# EAGLE design mains_top (EAGLE 8.6.0)
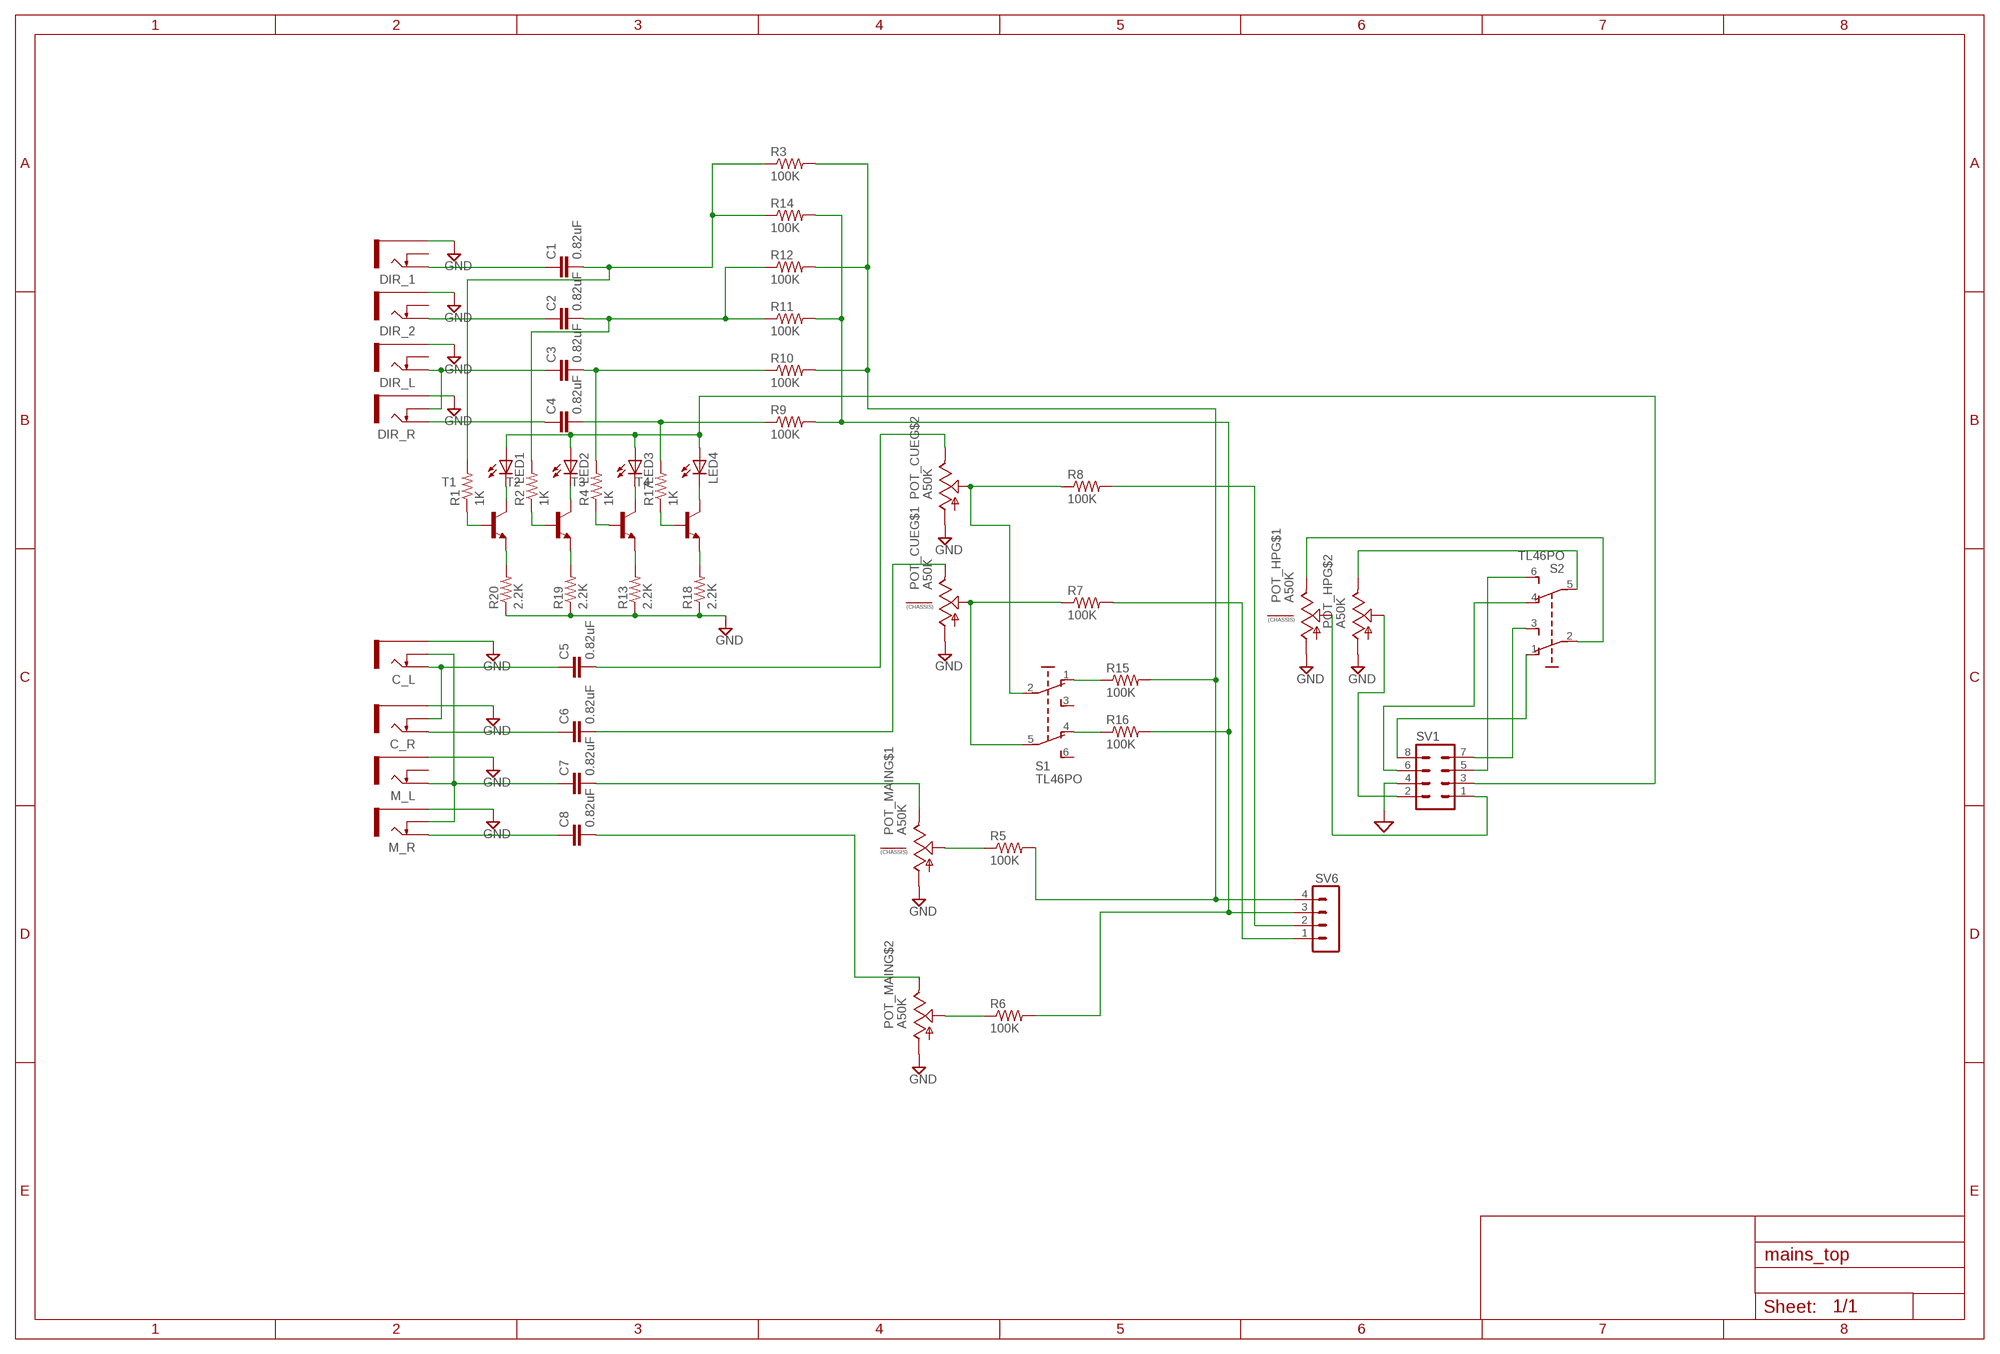
[diagram p0: schematic, sheet 1]

## Parts
C1  0.82uF  C-EUC0603K  [C0603K]
C2  0.82uF  C-EUC0603K  [C0603K]
C3  0.82uF  C-EUC0603K  [C0603K]
C4  0.82uF  C-EUC0603K  [C0603K]
C5  0.82uF  C-EUC0603K  [C0603K]
C6  0.82uF  C-EUC0603K  [C0603K]
C7  0.82uF  C-EUC0603K  [C0603K]
C8  0.82uF  C-EUC0603K  [C0603K]
C_L  THONKICONNNEW  [WQP-PJ301M-12_JACK]
C_R  THONKICONNNEW  [WQP-PJ301M-12_JACK]
DIR_1  THONKICONNNEW  [WQP-PJ301M-12_JACK]
DIR_2  THONKICONNNEW  [WQP-PJ301M-12_JACK]
DIR_L  THONKICONNNEW  [WQP-PJ301M-12_JACK]
DIR_R  THONKICONNNEW  [WQP-PJ301M-12_JACK]
LED1  LED3MM  [LED3MM]
LED2  LED3MM  [LED3MM]
LED3  LED3MM  [LED3MM]
LED4  LED3MM  [LED3MM]
M_L  THONKICONNNEW  [WQP-PJ301M-12_JACK]
M_R  THONKICONNNEW  [WQP-PJ301M-12_JACK]
POT_CUE  A50K  ALPHA-9MM-DUALPOT  [DUAL_9MM_SNAP-IN_POT]
POT_HP  A50K  ALPHA-9MM-DUALPOT  [DUAL_9MM_SNAP-IN_POT]
POT_MAIN  A50K  ALPHA-9MM-DUALPOT  [DUAL_9MM_SNAP-IN_POT]
R1  1K  R-US_R0603  [R0603]
R2  1K  R-US_R0603  [R0603]
R3  100K  R-US_R0603  [R0603]
R4  1K  R-US_R0603  [R0603]
R5  100K  R-US_R0603  [R0603]
R6  100K  R-US_R0603  [R0603]
R7  100K  R-US_R0603  [R0603]
R8  100K  R-US_R0603  [R0603]
R9  100K  R-US_R0603  [R0603]
R10  100K  R-US_R0603  [R0603]
R11  100K  R-US_R0603  [R0603]
R12  100K  R-US_R0603  [R0603]
R13  2.2K  R-US_R0603  [R0603]
R14  100K  R-US_R0603  [R0603]
R15  100K  R-US_R0603  [R0603]
R16  100K  R-US_R0603  [R0603]
R17  1K  R-US_R0603  [R0603]
R18  2.2K  R-US_R0603  [R0603]
R19  2.2K  R-US_R0603  [R0603]
R20  2.2K  R-US_R0603  [R0603]
S1  TL46PO  [TL4XPO]
S2  TL46PO  [TL4XPO]
SV1  MA04-2  [MA04-2]
SV6  MA04-1  [MA04-1]
T1  MMBT3904LT1-NPN-SOT23-BEC  [SOT23-BEC]
T2  MMBT3904LT1-NPN-SOT23-BEC  [SOT23-BEC]
T3  MMBT3904LT1-NPN-SOT23-BEC  [SOT23-BEC]
T4  MMBT3904LT1-NPN-SOT23-BEC  [SOT23-BEC]

## Nets
GND: C_L.P$3_SLEEVE(SLEEVE) C_R.P$3_SLEEVE(SLEEVE) DIR_1.P$3_SLEEVE(SLEEVE) DIR_2.P$3_SLEEVE(SLEEVE) DIR_L.P$3_SLEEVE(SLEEVE) DIR_R.P$3_SLEEVE(SLEEVE) M_L.P$3_SLEEVE(SLEEVE) M_R.P$3_SLEEVE(SLEEVE) POT_CUE.1(A) POT_CUE.1B(A) POT_HP.1(A) POT_HP.1B(A) POT_MAIN.1(A) POT_MAIN.1B(A) R13.1 R18.1 R19.1 R20.1 SV1.4 ; supply symbol labelled SUP
N$3: S2.1(O) SV1.8
N$4: R20.2 T1.E
N$5: R19.2 T2.E
N$6: S2.4(O1) SV1.6
N$7: LED1.K(C) T1.C
N$8: POT_HP.2B(S) SV1.2
N$9: C7.1 C_L.P$2_SWITCH(SWITCH) M_L.P$1_TIP(TIP) M_R.P$2_SWITCH(SWITCH)
N$10: POT_HP.2(S) SV1.1
N$11: R1.1 T1.B
N$12: R2.1 T2.B
N$13: LED1.A LED2.A LED3.A LED4.A SV1.3
N$14: C8.2 POT_MAIN.3B(E)
N$15: C3.2 R4.2 R10.1
N$16: C4.2 R9.1 R17.2
N$17: C2.1 DIR_2.P$1_TIP(TIP)
N$18: C1.1 DIR_1.P$1_TIP(TIP)
N$19: C6.2 POT_CUE.3(E)
N$20: C5.2 POT_CUE.3B(E)
N$21: POT_CUE.2B(S) R8.1 S1.2(P)
N$22: LED3.K(C) T3.C
N$23: POT_MAIN.2(S) R5.1
N$24: POT_MAIN.2B(S) R6.1
N$25: S2.6(S1) SV1.5
N$26: LED4.K(C) T4.C
N$27: S2.3(S) SV1.7
N$28: R17.1 T4.B
N$29: POT_HP.3B(E) S2.5(P1)
N$30: POT_HP.3(E) S2.2(P)
N$31: R15.1 S1.1(O)
N$32: R16.1 S1.4(O1)
N$33: R6.2 R9.2 R11.2 R14.2 R16.2 SV6.3
N$34: R4.1 T3.B
N$35: R7.2 SV6.1
N$36: R8.2 SV6.2
N$37: LED2.K(C) T2.C
N$39: R13.2 T3.E
N$40: R18.2 T4.E
N$41: POT_CUE.2(S) R7.1 S1.5(P1)
N$42: C3.1 DIR_L.P$1_TIP(TIP) DIR_R.P$2_SWITCH(SWITCH)
N$43: C2.2 R2.2 R11.1 R12.1
N$44: C1.2 R1.2 R3.1 R14.1
N$45: C4.1 DIR_R.P$1_TIP(TIP)
N$46: C7.2 POT_MAIN.3(E)
N$47: C5.1 C_L.P$1_TIP(TIP) C_R.P$2_SWITCH(SWITCH)
N$48: C8.1 M_R.P$1_TIP(TIP)
N$49: C6.1 C_R.P$1_TIP(TIP)
N$51: R3.2 R5.2 R10.2 R12.2 R15.2 SV6.4
Unconnected: DIR_1.P$2_SWITCH(SWITCH) DIR_2.P$2_SWITCH(SWITCH) DIR_L.P$2_SWITCH(SWITCH) M_L.P$2_SWITCH(SWITCH) POT_CUE.CHASSIS1 POT_CUE.CHASSIS2 POT_HP.CHASSIS1 POT_HP.CHASSIS2 POT_MAIN.CHASSIS1 POT_MAIN.CHASSIS2 S1.3(S) S1.6(S1)

## Library data of the parts
C1-C8 = resistor:C-EU: CAPACITOR, European symbol
C_L C_R DIR_1 DIR_2 DIR_L DIR_R M_L M_R = MusicThingModular:THONKICONN: 3.5mm socket for Eurorack modular synths
LED1-LED4 = led:LED: LED OSRAM: - CHIPLED LG R971, LG N971, LY N971, LG Q971, LY Q971, LO R971, LY R971 LH N974, LH R974 LS Q976, LO Q976, LY Q976 LO Q996 - Hyper CHIPLED LW Q18S LB Q993, LB Q99A, LB R99A - SideLED LS A670, LO A670, LY A670, LG A670, LP A670 LB A673, LV A673, LT A673, LW A673 LH A674 LY A675 LS A676, LA A676, LO A676, LY A676, LW A676 LS A679, LY A679, LG A679 - Hyper Micro SIDELED® LS Y876, LA Y876, LO Y876, LY Y876 LT Y87S - SmartLED LW L88C, LW L88S LB L89C, LB L89S, LG L890 LS L89K, LO L89K, LY L89K LS L896, LA L896, LO L896, LY L896 - TOPLED LS T670, LO T670, LY T670, LG T670, LP T670 LSG T670, LSP T670, LSY T670, LOP T670, LYG T670 LG T671, LOG T671, LSG T671 LB T673, LV T673, LT T673, LW T673 LH T674 LS T676, LA T676, LO T676, LY T676, LB T676, LH T676, LSB T676, LW T676 LB T67C, LV T67C, LT T67C, LS T67K, LO T67K, LY T67K, LW E67C LS E67B, LA E67B, LO E67B, LY E67B, LB E67C, LV E67C, LT E67C LW T67C LS T679, LY T679, LG T679 LS T770, LO T770, LY T770, LG T770, LP T770 LB T773, LV T773, LT T773, LW T773 LH T774 LS E675, LA E675, LY E675, LS T675 LS T776, LA T776, LO T776, LY T776, LB T776 LHGB T686 LT T68C, LB T68C - Hyper Mini TOPLED® LB M676 - Mini TOPLED Santana® LG M470 LS M47K, LO M47K, LY M47K Source: http://www.osram.convergy.de LUXEON: - LUMILED® LXK2-PW12-R00, LXK2-PW12-S00, LXK2-PW14-U00, LXK2-PW14-V00 LXK2-PM12-R00, LXK2-PM12-S00, LXK2-PM14-U00 LXK2-PE12-Q00, LXK2-PE12-R00, LXK2-PE12-S00, LXK2-PE14-T00, LXK2-PE14-U00 LXK2-PB12-K00, LXK2-PB12-L00, LXK2-PB12-M00, LXK2-PB14-N00, LXK2-PB14-P00, LXK2-PB14-Q00 LXK2-PR12-L00, LXK2-PR12-M00, LXK2-PR14-Q00, LXK2-PR14-R00 LXK2-PD12-Q00, LXK2-PD12-R00, LXK2-PD12-S00 LXK2-PH12-R00, LXK2-PH12-S00 LXK2-PL12-P00, LXK2-PL12-Q00, LXK2-PL12-R00 Source: www.luxeon.com KINGBRIGHT: KA-3528ASYC Source: www.kingbright.com
POT_CUE POT_HP POT_MAIN = MusicThingModular:ALPHA-9MM-DUALPOT: 9mm vertical snap-in pot, Alpha / Panasonic style, with a connection to the metal chassis for grounding
R1-R20 = resistor:R-US_: RESISTOR, American symbol
S1 S2 = switch:TL46PO: TINY SWITCH ON - ON Source: http://www2.produktinfo.conrad.com/datenblaetter/700000-724999/705152-da-01-de-Subminiaturschalter_TL_36YO.pdf
SV1 = con-lstb:MA04-2: PIN HEADER; OC_FARNELL: unknown; OC_NEWARK: unknown
SV6 = con-lstb:MA04-1: PIN HEADER; OC_FARNELL: unknown; OC_NEWARK: unknown
T1-T4 = transistor:*-NPN-: NPN Transistror BF959 corrected 2008.03.06

## Board
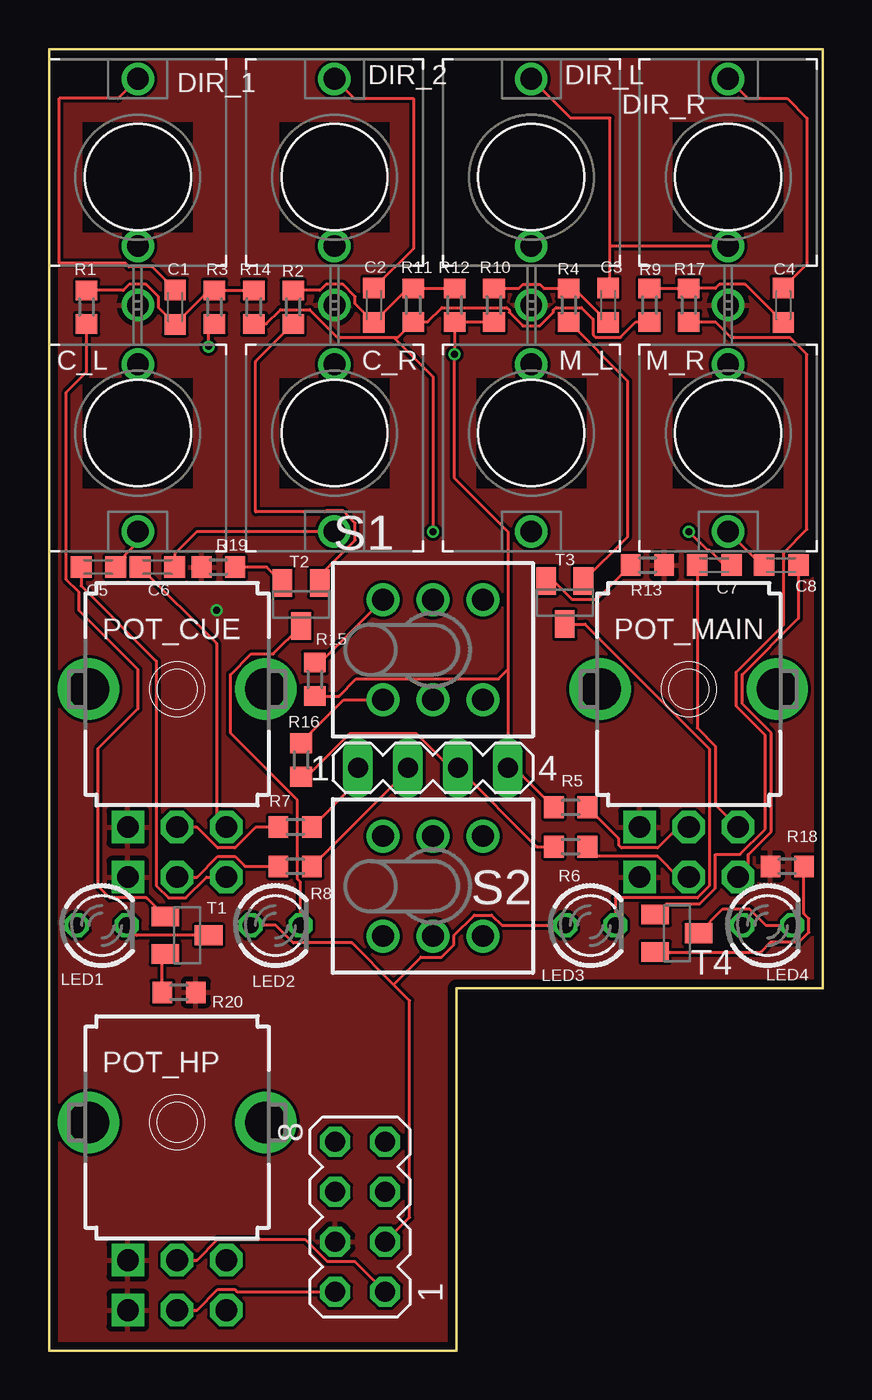
[diagram p1: board, top side]
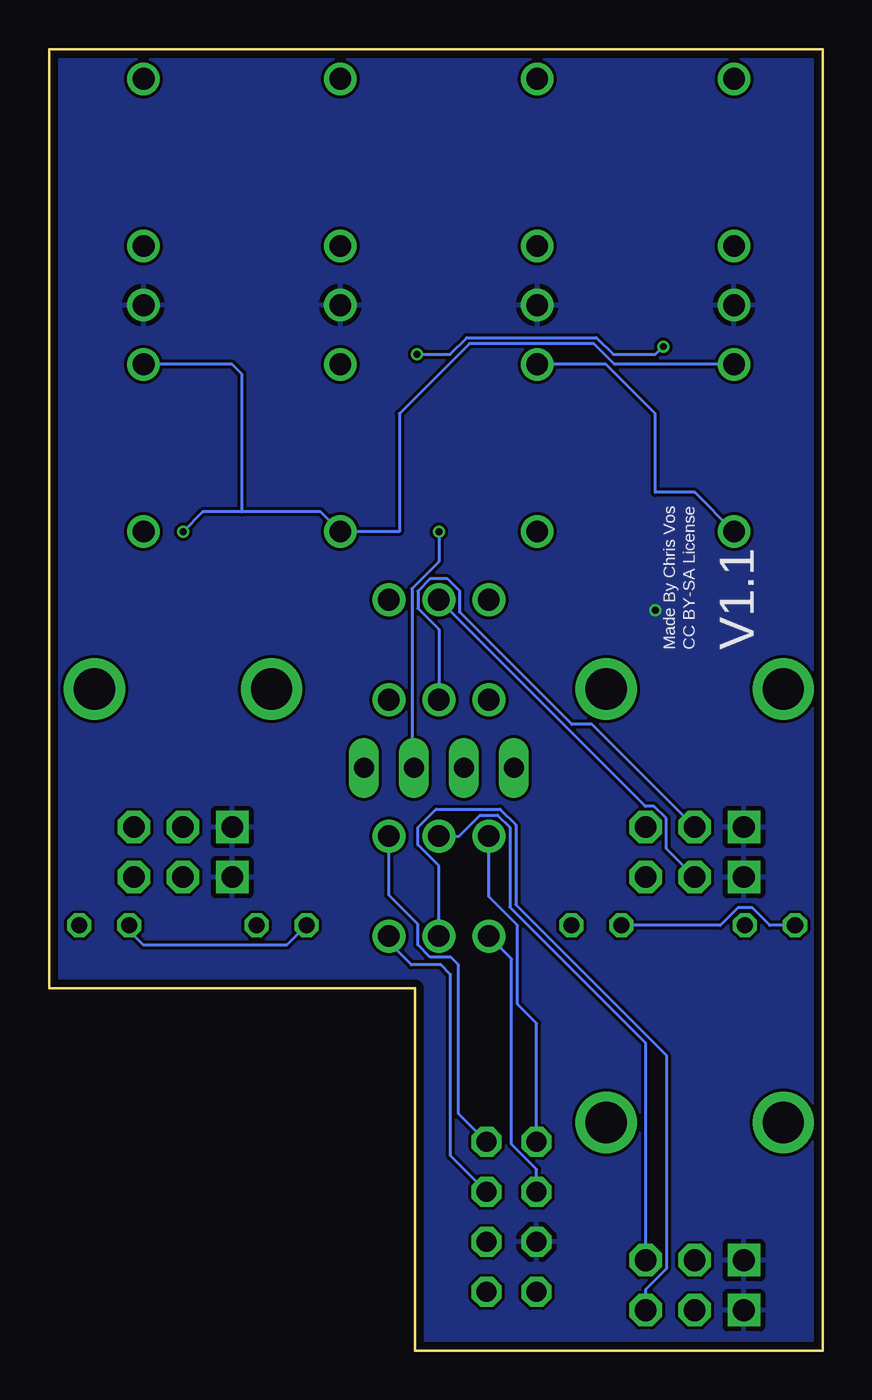
[diagram p2: board, bottom side, seen from below]

Size 39.3 x 66.1 mm. Coordinates in mm from the lower left corner, seen from the top.
Outline: 0,0 20.7,0 20.7,18.4 39.3,18.4 39.3,66.1 0,66.1 0,0
Copper layers (1*16): Top 0.035559375mm / dielectric 1.6mm / Bottom 0.035559375mm
Design rules "oshpark-2layer": minimum track width 6mil, minimum drill 10mil, track to track 6mil, track to pad 6mil, pad to pad 6mil, via to via 6mil, smd to smd 6mil, copper to edge 15mil, drill to drill 6mil, minimum pad ring 5mil, minimum via ring 5mil, stop-mask expansion 2.5mil, vias tented up to drill 0mil, thermal gap 10mil

### Footprints (pad centres in the part's own frame; a part is rotated, then mirrored left to right if it is on the bottom)
C0603K = smd 1.05 x 1.08: 1 -0.875,0; 2 0.875,0
WQP-PJ301M-12_JACK = drill 1.1: P$1_TIP 0,5; P$2_SWITCH 0,-3.5; P$3_SLEEVE 0,-6.5
LED3MM = drill 0.813 octagon: A -1.27,0; K 1.27,0
DUAL_9MM_SNAP-IN_POT = drill 1.1 square: 1 -2.5,-7; 1B -2.5,-9.54 | drill 1.1 octagon: 2 0,-7; 2B 0,-9.54; 3 2.5,-7; 3B 2.5,-9.54 | drill 2.1 pad 2.54: CHASSIS1 -4.5,0; CHASSIS2 4.5,0
R0603 = smd 1 x 1.1: 1 -0.85,0; 2 0.85,0
TL4XPO = drill 1.1 pad 1.676: 1 -2.54,2.54; 2 0,2.54; 3 2.54,2.54; 4 -2.54,-2.54; 5 0,-2.54; 6 2.54,-2.54
MA04-2 = drill 1.016 octagon: 1 -3.81,-1.27; 2 -3.81,1.27; 3 -1.27,-1.27; 4 -1.27,1.27; 5 1.27,-1.27; 6 1.27,1.27; 7 3.81,-1.27; 8 3.81,1.27
MA04-1 = drill 1.016 long: 1 -3.81,0; 2 -1.27,0; 3 1.27,0; 4 3.81,0
SOT23-BEC = smd 1 x 1.4: B -0.95,-1.1; C 0,1.1; E 0.95,-1.1

### Placement (x,y rotation side)
C1  6.4,53 270 top
C2  16.5,53.1 270 top
C3  28.4,53.1 270 top
C4  37.3,53.1 270 top
C5  2.5,39.8 180 top
C6  5.5,39.8 180 top
C7  33.8,39.9 180 top
C8  37.2,39.9 0 top
C_L  4.5,46.6 180 top
C_R  14.5,46.6 180 top
DIR_1  4.5,59.6 0 top
DIR_2  14.5,59.6 0 top
DIR_L  24.5,59.6 0 top
DIR_R  34.5,59.6 0 top
LED1  2.67,21.6 0 top
LED2  11.5,21.6 0 top
LED3  27.5,21.6 0 top
LED4  36.5,21.6 0 top
M_L  24.5,46.6 180 top
M_R  34.5,46.6 180 top
POT_CUE  6.5,33.6 0 top
POT_HP  6.5,11.6 0 top
POT_MAIN  32.5,33.6 0 top
R1  1.9,53 90 top
R2  12.4,53 90 top
R3  8.4,53 270 top
R4  26.4,53.1 90 top
R5  26.5,27.6 180 top
R6  26.5,25.6 180 top
R7  12.5,26.6 0 top
R8  12.5,24.6 0 top
R9  30.5,53.1 270 top
R10  22.6,53.1 270 top
R11  18.5,53.1 270 top
R12  20.6,53.1 270 top
R13  30.4,39.9 180 top
R14  10.4,53 270 top
R15  13.5,34.1 270 top
R16  12.8,30 270 top
R17  32.5,53.1 90 top
R18  37.5,24.6 0 top
R19  8.6,39.8 0 top
R20  6.6,18.2 180 top
S1  19.5,35.6 0 top
S2  19.5,23.6 0 top
SV1  15.8,6.8 90 top
SV6  19.5,29.6 0 top
T1  7,21.1 270 top
T2  12.8,37.9 180 top
T3  26.2,38 180 top
T4  31.9,21.2 270 top

### Tracks (layer width: path | path; a pad name or v marks a point on that pad's centre or on a via)
GND  (via drill 0.35)
  other vias: 8.5,37.6
  pour Bottom: 0,0 20.7,0 20.7,18.4 39.3,18.4 39.3,66.1 0,66.1
  pour Top: 0,0 20.7,0 20.7,18.4 39.3,18.4 39.3,66.1 0,66.1
N$3
  Bottom 0.152: SV1.8 14.53,16.63 15.5,17.6 15.5,21.6 16.96,23.06 S2.1
N$4
  Top 0.152: R20.2 5.75,20 T1.E
N$5
  Top 0.152: T2.E 11.05,39.8 R19.2
N$6
  Bottom 0.152: S2.4 15.8,19.91 15.8,10.48 14.53,9.21 SV1.6
N$7
  Top 0.152: T1.C 4.44,21.1 LED1.K
N$8
  Top 0.152: POT_HP.2B 7.51,2.06 8.56,3.11 9.44,3.11 9.56,2.99 SV1.2
N$9  (via drill 0.35)
  Top 0.152: v32.5,41.6 33.43,40.67 33.55,40.67 34.31,39.9 C7.1
  Bottom 0.152: 29.5,42.6 25.5,42.6 M_L.P$1_TIP 21.5,41.6 21.5,47.6 17.95,51.15 11.62,51.15 10.57,50.1 C_L.P$2_SWITCH | 29.5,42.6 29.5,49.6 30,50.1 M_R.P$2_SWITCH | 29.5,42.6 31.5,42.6 v32.5,41.6
N$10
  Top 0.152: POT_HP.2 7.51,4.6 8.56,5.65 13.01,5.65 14.12,4.54 15.52,4.54 SV1.1
N$11
  Top 0.152: T1.B 4.94,23.01 3.08,23.01 2.5,23.59 2.5,30.6 4.5,32.6 4.5,34.6 1.5,37.6 1.5,38.54 0.87,39.16 0.87,48.68 1.9,49.71 R1.1
N$12
  Top 0.152: T2.B 13.75,39.36 15.55,41.16 15.55,42.04 14.94,42.65 14.06,42.65 14.01,42.6 10.5,42.6 10.5,50.25 R2.1
N$13
  Top 0.152: SV1.3 18.32,6.78 18.32,17.78 17.5,18.6 | LED3.A 23.01,21.6 22.48,22.13 21.6,22.13 20.57,21.09 20.57,20.62 19.94,19.99 18.89,19.99 17.5,18.6 | LED2.A 11.51,21.6 12.4,20.71 15.39,20.71 17.5,18.6
  Bottom 0.152: LED3.A 27.23,20.6 34.5,20.6 35.23,21.33 LED4.A | LED1.A 2.68,21.6 3.57,22.49 4.31,22.49 5.2,21.6 LED2.A
N$14
  Top 0.152: POT_MAIN.3B 35.52,24.58 35.52,25.2 36.69,26.37 36.69,31.39 35.21,32.86 35.21,34.34 38.08,37.2 C8.2
N$15
  Top 0.152: R10.1 23.86,53.95 24.06,54.15 24.94,54.15 25.14,53.95 R4.2 26.68,53.95 C3.2
N$16
  Top 0.152: C4.2 35.37,54.15 34.06,54.15 33.86,53.95 R17.2 R9.1
N$17
  Top 0.152: DIR_2.P$1_TIP 15.5,63.6 18.5,63.6 18.5,55.98 C2.1
N$18
  Top 0.152: DIR_1.P$1_TIP 3.5,63.6 0.52,63.6 0.52,55.23 3.88,55.23 4.06,55.05 5.23,55.05 C1.1
N$19
  Top 0.152: C6.2 8.5,35.93 8.5,27.1 POT_CUE.3
N$20
  Top 0.152: C5.2 1.62,38.84 5.45,35.02 5.45,23.62 6.06,23.01 6.94,23.01 7.99,24.06 POT_CUE.3B
N$21
  Top 0.152: POT_CUE.2B 7.51,24.06 8.56,25.11 9.44,25.11 9.95,24.6 R8.1
  Bottom 0.152: POT_CUE.2B 7.95,25.51 7.95,27.04 8.56,27.65 9.01,27.65 S1.2
N$22
  Top 0.152: LED3.K 28.77,23.01 32.94,23.01 33.55,23.62 33.55,30.57 27.23,36.9 T3.C
N$23
  Top 0.152: POT_MAIN.2 31.97,26.6 30.92,25.55 29.08,25.55 28.95,25.68 28.95,26 R5.1
N$24
  Top 0.152: POT_MAIN.2B 31.97,24.06 30.92,25.11 27.84,25.11 R6.1
N$25
  Bottom 0.152: SV1.5 18.9,9.9 18.9,19.1 19.4,19.6 20.9,19.6 22.04,20.74 S2.6
N$26
  Top 0.152: LED4.K 36.41,21.6 35.58,22.44 34.24,22.44 T4.C
N$27
  Bottom 0.152: SV1.7 18.5,12.04 18.5,19.6 18.89,19.99 19.94,19.99 20.57,20.62 20.57,21.67 22.04,23.14 S2.3
N$28
  Top 0.152: R17.1 33.86,52.25 34.64,51.47 37.63,51.47 38.5,50.6 38.5,41.71 37.32,40.54 37.32,36.88 34.91,34.47 34.91,32.73 36.38,31.26 36.38,26.49 35.1,25.21 33.86,25.21 33.86,23.5 33.06,22.7 31.35,22.7 T4.B
N$29
  Bottom 0.152: POT_HP.3B 9,3.11 7.95,4.16 7.95,15.02 15.59,22.66 15.59,26.71 16.39,27.51 19.64,27.51 20.57,26.58 20.57,25.7 19.5,24.63 S2.5
N$30
  Bottom 0.152: POT_HP.3 9,13.6 9,15.64 15.89,22.53 15.89,26.58 16.52,27.21 17.4,27.21 18.47,26.14 S2.2
N$31
  Top 0.152: R15.1 13.77,34.95 S1.1
N$32
  Top 0.152: R16.1 12.8,30.9 14.96,33.06 S1.4
N$33  (via drill 0.35)
  Top 0.152: R16.2 13.08,29.15 15.28,31.35 18.64,31.35 20.39,29.6 SV6.3 24.77,25.6 R6.2 | R14.2 11.03,52.15 11.76,52.88 13.23,52.88 14.64,51.47 17.5,51.47 | 17.5,51.47 17.72,51.47 R11.2 19.23,52.25 19.95,52.98 23.25,52.98 23.38,52.85 23.38,52.73 24.06,52.05 24.94,52.05 25.62,52.73 25.62,52.85 25.75,52.98 27.05,52.98 27.63,52.39 27.63,51.6 27.77,51.47 29.04,51.47 29.81,52.25 R9.2 | 17.5,51.47 19.5,49.47 v19.5,41.6
  Bottom 0.152: v19.5,41.6 19.5,40.08 20.87,38.71 20.87,30.11 20.77,30.01 SV6.3
N$34
  Top 0.152: T3.B 29.4,41.35 29.4,49.25 R4.1
N$35
  Top 0.152: R7.2 15.69,28.94 SV6.1
N$36
  Top 0.152: R8.2 18.23,29.48 SV6.2
N$37
  Top 0.152: LED2.K 12.77,23.81 12.62,23.96 12.62,27.96 9.21,31.36 9.21,34.34 10.26,35.39 11.39,35.39 T2.C
N$39
  Top 0.152: T3.E 25.63,39.1 26.55,38.17 27.82,38.17 R13.2
N$40
  Top 0.152: T4.E 36.15,20.25 36.66,20.76 38.12,20.76 38.61,21.25 38.61,21.95 38.35,22.2 R18.2
N$41
  Top 0.152: R7.1 10.49,26.6 9.44,25.55 8.56,25.55 7.51,26.6 POT_CUE.2
  Bottom 0.152: POT_CUE.2 11.71,31.81 12.74,31.81 18.43,37.5 18.43,38.58 19.06,39.21 19.94,39.21 20.57,38.58 20.57,37.7 19.5,36.63 S1.5
N$42
  Top 0.152: C3.1 28.5,54.07 28.5,56.1 | 28.5,56.1 28.5,62.6 26.5,62.6 DIR_L.P$1_TIP | DIR_R.P$2_SWITCH 28.5,56.1
N$43
  Top 0.152: R12.1 R11.1 18.23,53.95 C2.2 15.55,53.17 15.55,53.54 14.94,54.15 14.06,54.15 13.76,53.85 R2.2
N$44
  Top 0.152: R14.1 R3.1 8.12,53.85 C1.2 5.55,52.97 5.55,53.54 4.94,54.15 4.06,54.15 3.76,53.85 R1.2
N$45
  Top 0.152: DIR_R.P$1_TIP 35.5,63.6 37.5,63.6 38.5,62.6 38.5,55.18 C4.1
N$46
  Top 0.152: C7.2 32.92,31.63 33.86,30.7 33.86,27.74 POT_MAIN.3
N$47
  Top 0.152: C5.1 3.87,40.3 3.87,40.43 4.5,41.06 C_L.P$1_TIP
  Bottom 0.152: C_L.P$1_TIP 6.5,43.6 8.5,43.6 8.5,47.6 11,50.1 C_R.P$2_SWITCH
N$48
  Top 0.152: M_R.P$1_TIP 36.2,39.9 C8.1
N$49
  Top 0.152: C_R.P$1_TIP 7.5,41.6 6.38,40.48 C6.1
N$51  (via drill 0.35)
  Top 0.152: 23.31,34.6 23.31,41.6 20.6,44.31 v20.6,50.6 R12.2 R10.2 | 23.31,34.6 22.84,34.13 15.6,34.13 14.72,33.25 R15.2 | 23.31,34.6 SV6.4 23.65,29.6 R5.2 | v8.1,51 8.1,51.85 R3.2
  Bottom 0.152: v20.6,50.6 18.93,50.6 18.07,51.46 11.5,51.46 10.64,50.6 8.5,50.6 v8.1,51

### Text on the board
bPlace: V1.1
bNames: CC BY-SA License | Made By Chris Vos